# EAGLE design Rpi Shield V1.2 (EAGLE 9.5.2)
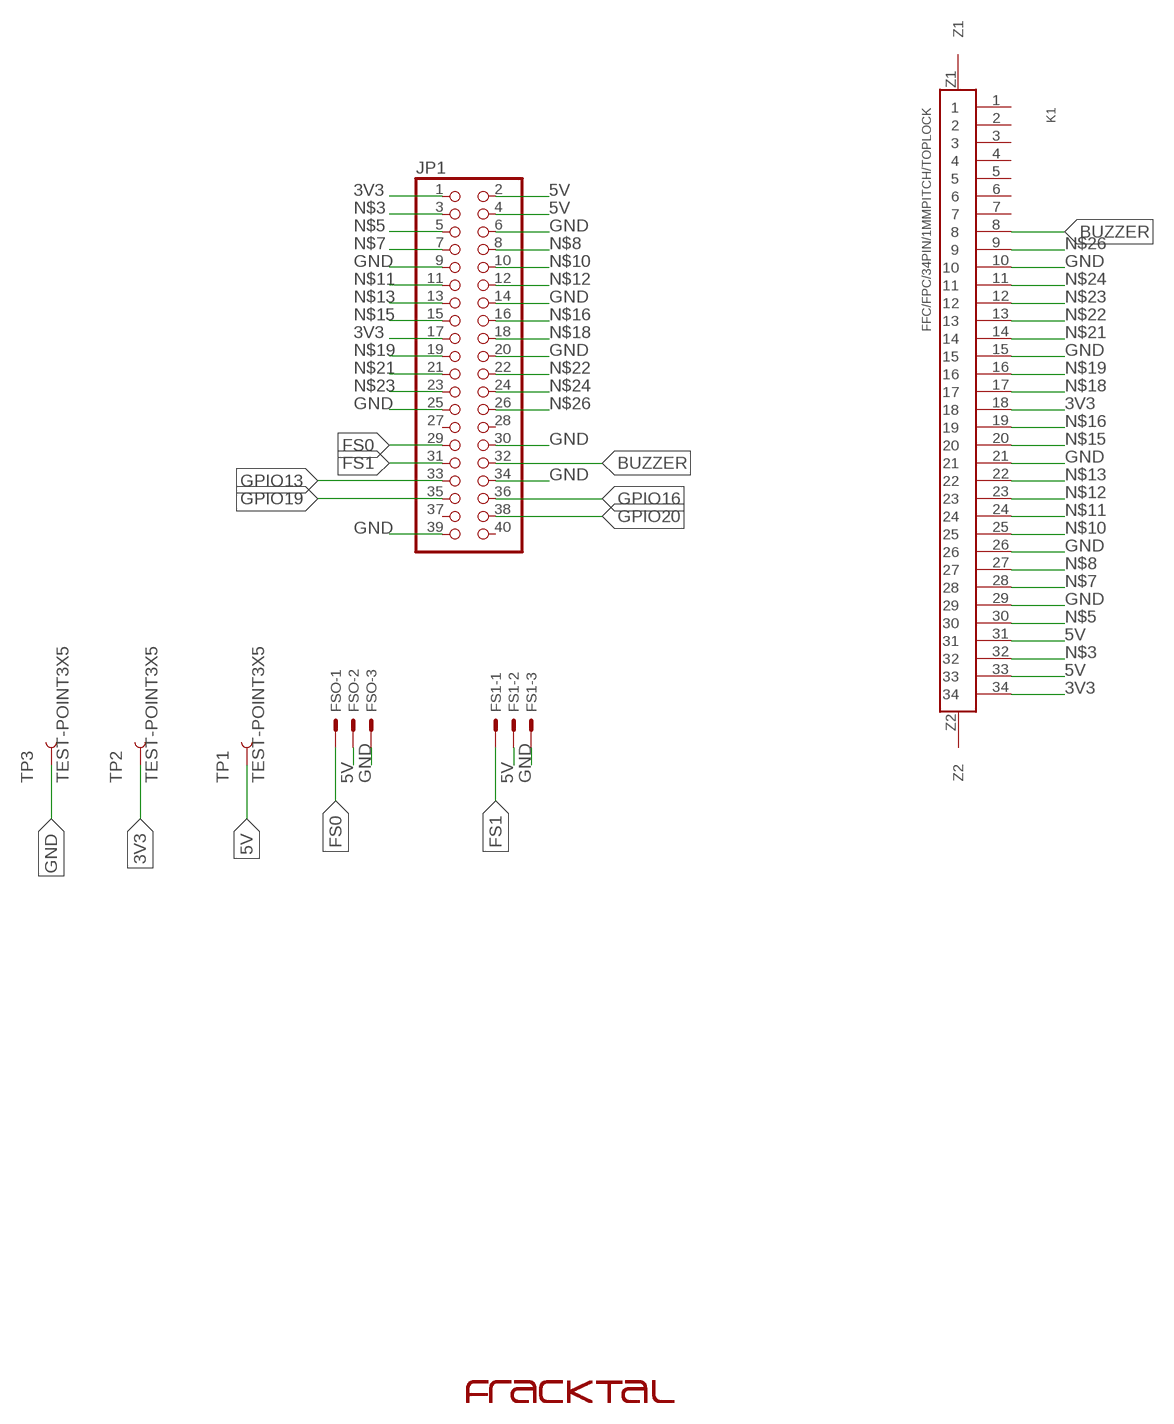
[diagram p0: schematic, sheet 1]

## Parts
FS1  JST-XH-03-PIN-LONG-PAD  [JST-XH-03-PACKAGE-LONG-PAD]
FSO  JST-XH-03-PIN-LONG-PAD  [JST-XH-03-PACKAGE-LONG-PAD]
JP1  RASPBERRYPI_3B_GPIO  [RASPBERRYPI_3B_GPIO]
K1  FFC/FPC/34PIN/1MMPITCH/TOPLOCK  [FFC/FPC/34PIN/1MMPITCH/TOPLOCK]
TP1  TEST-POINT3X5  [PAD.03X.05]
TP2  TEST-POINT3X5  [PAD.03X.05]
TP3  TEST-POINT3X5  [PAD.03X.05]
U$1  FRACKTALLOGO  [FRACKTALLOGO]

## Nets
3V3: JP1.1 JP1.17 K1.18 K1.34 TP2.P$1
5V: FS1.2 FSO.2 JP1.2 JP1.4 K1.31 K1.33 TP1.P$1
BUZZER: JP1.32 K1.8
FS0: FSO.1 JP1.29
FS1: FS1.1 JP1.31
GND: FS1.3 FSO.3 JP1.6 JP1.9 JP1.14 JP1.20 JP1.25 JP1.30 JP1.34 JP1.39 K1.10 K1.15 K1.21 K1.26 K1.29 TP3.P$1
GPIO13: JP1.33
GPIO16: JP1.36
GPIO19: JP1.35
GPIO20: JP1.38
N$3: JP1.3 K1.32
N$5: JP1.5 K1.30
N$7: JP1.7 K1.28
N$8: JP1.8 K1.27
N$10: JP1.10 K1.25
N$11: JP1.11 K1.24
N$12: JP1.12 K1.23
N$13: JP1.13 K1.22
N$15: JP1.15 K1.20
N$16: JP1.16 K1.19
N$18: JP1.18 K1.17
N$19: JP1.19 K1.16
N$21: JP1.21 K1.14
N$22: JP1.22 K1.13
N$23: JP1.23 K1.12
N$24: JP1.24 K1.11
N$26: JP1.26 K1.9
Unconnected: JP1.27 JP1.28 JP1.37 JP1.40 K1.1 K1.2 K1.3 K1.4 K1.5 K1.6 K1.7 K1.Z1 K1.Z2

## Library data of the parts
FS1 FSO = Rembrandt:JST-XH-03-PIN: JST XH Connector 2 Pin Wire to board connector. Pitch: 2,54 mm, (0.100") Number of pins: 3 Created by Rembrandt Electronics www.rembrandtelectronics.com
JP1 = FracktalWorks:RASPBERRYPI_3B_GPIO
K1 = FracktalWorks:FFC/FPC/34PIN/1MMPITCH/TOPLOCK
TP1-TP3 = SparkFun-Connectors:TEST-POINT: SparkFun Test Points Bare copper test points for troubleshooting or In-Circuit-Testing. These are used by our Production team for verifying production board runs using pogo-pins on test beds. SparkFun Products: SparkFun LSM9DS1 Breakout <https://www.sparkfun.com/products/13284> SparkFun PSOC <https://www.sparkfun.com/products/13714> SparkFun Load Cell Amplifier <https://www.sparkfun.com/products/13879>
U$1 = FracktalWorks_Eagle_Library:FRACKTALLOGO

## Net classes
0 default: width 0.406 mm

## Board
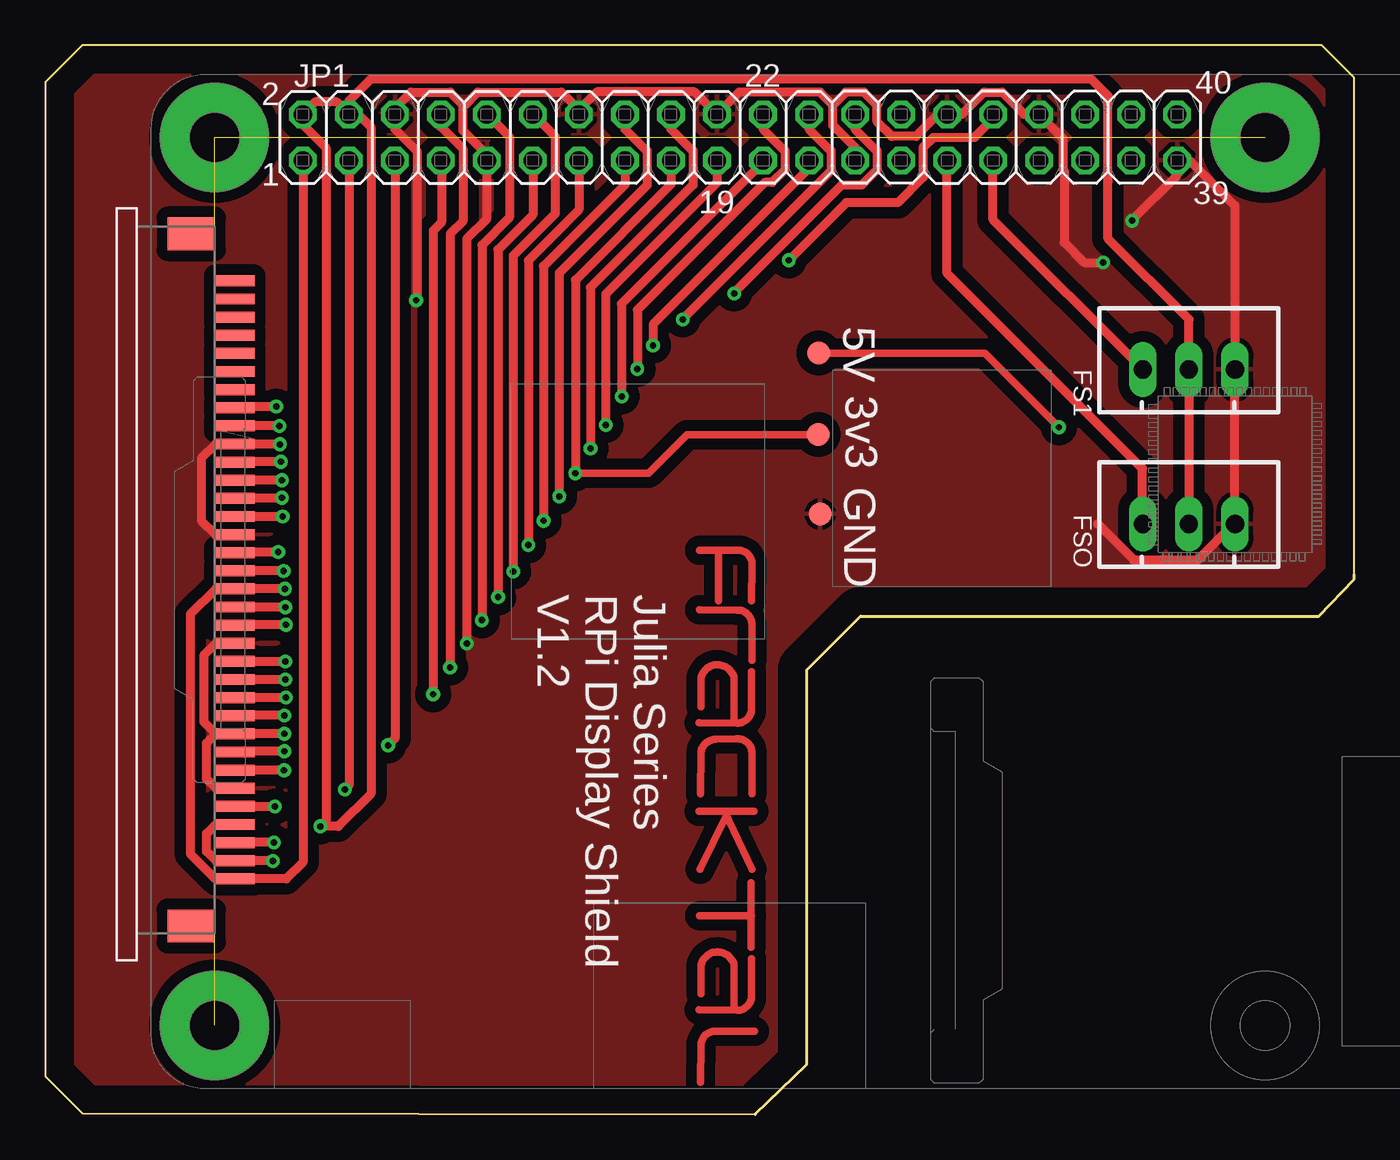
[diagram p1: board, top side]
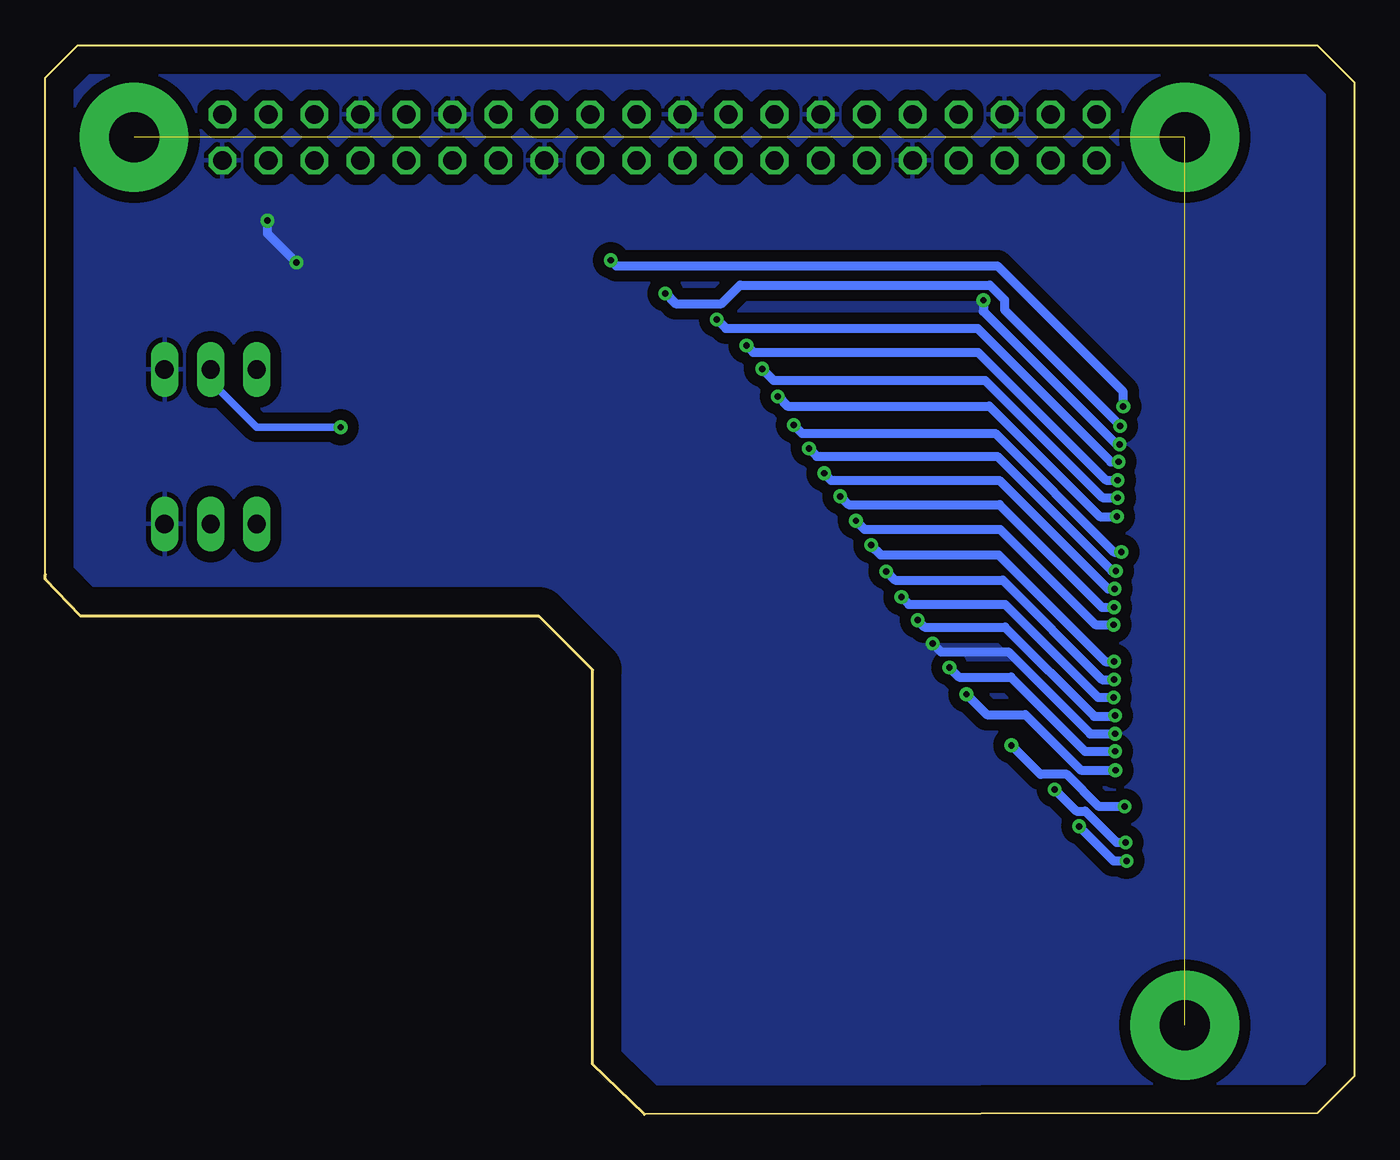
[diagram p2: board, bottom side, seen from below]

Size 72.26 x 59 mm. Coordinates in mm from the lower left corner, seen from the top.
Outline: 0,56.97 0,2.11 2.03,0.08 39.19,0 42.04,2.77 42.04,24.54 45.01,27.51 70.31,27.51 72.26,29.54 72.26,29.79 72.26,57.23 70.48,59 2.03,59 0,56.97
Copper layers (1*16): Top 0.035mm / dielectric 1.5mm / Bottom 0.035mm
Design rules "LionCircuits": minimum track width 8mil, minimum drill 0.35mm, track to track 8mil, track to pad 8mil, pad to pad 8mil, via to via 8mil, smd to smd 8mil, copper to edge 60mil, drill to drill 10mil, minimum pad ring 10mil, minimum via ring 8mil, stop-mask expansion 4mil, vias tented up to drill 0mil, thermal gap 10mil

### Footprints (pad centres in the part's own frame; a part is rotated, then mirrored left to right if it is on the bottom)
JST-XH-03-PACKAGE-LONG-PAD = drill 1.016 long: 1 -2.54,0; 2 0,0; 3 2.54,0
RASPBERRYPI_3B_GPIO = drill 1.016 octagon: 1 -24.13,-1.27; 2 -24.13,1.27; 3 -21.59,-1.27; 4 -21.59,1.27; 5 -19.05,-1.27; 6 -19.05,1.27; 7 -16.51,-1.27; 8 -16.51,1.27; 9 -13.97,-1.27; 10 -13.97,1.27; 11 -11.43,-1.27; 12 -11.43,1.27; 13 -8.89,-1.27; 14 -8.89,1.27; 15 -6.35,-1.27; 16 -6.35,1.27; 17 -3.81,-1.27; 18 -3.81,1.27; 19 -1.27,-1.27; 20 -1.27,1.27; 21 1.27,-1.27; 22 1.27,1.27; 23 3.81,-1.27; 24 3.81,1.27; 25 6.35,-1.27; 26 6.35,1.27; 27 8.89,-1.27; 28 8.89,1.27; 29 11.43,-1.27; 30 11.43,1.27; 31 13.97,-1.27; 32 13.97,1.27; 33 16.51,-1.27; 34 16.51,1.27; 35 19.05,-1.27; 36 19.05,1.27; 37 21.59,-1.27; 38 21.59,1.27; 39 24.13,-1.27; 40 24.13,1.27
FFC/FPC/34PIN/1MMPITCH/TOPLOCK = smd 0.6 x 2.2: 1 -14.43,2.1; 2 -13.43,2.1; 3 -12.43,2.1; 4 -11.43,2.1; 5 -10.43,2.1; 6 -9.43,2.1; 7 -8.43,2.1; 8 -7.43,2.1; 9 -6.43,2.1; 10 -5.43,2.1; 11 -4.43,2.1; 12 -3.43,2.1; 13 -2.43,2.1; 14 -1.43,2.1; 15 -0.43,2.1; 16 0.57,2.1; 17 1.57,2.1; 18 2.57,2.1; 19 3.57,2.1; 20 4.57,2.1; 21 5.57,2.1; 22 6.57,2.1; 23 7.57,2.1; 24 8.57,2.1; 25 9.57,2.1; 26 10.57,2.1; 27 11.57,2.1; 28 12.57,2.1; 29 13.57,2.1; 30 14.57,2.1; 31 15.57,2.1; 32 16.57,2.1; 33 17.57,2.1; 34 18.57,2.1 | smd 1.8 x 2.6: Z1 -17.03,-0.3; Z2 21.17,-0.3
PAD.03X.05 = smd 1.27 x 1.27: P$1 0,0

### Placement (x,y rotation side)
FS1  63.13,41.11 0 top
FSO  63.13,32.59 0 top
JP1  38.35,53.92 0 top
K1  8.36,31.57 270 top
TP1  42.7,42.01 0 top
TP2  42.67,37.52 0 top
TP3  42.77,33.15 0 top
U$1  36.02,19.15 270 top

### Tracks (layer width: path | path; a pad name or v marks a point on that pad's centre or on a via)
3V3  (via drill 0.35)
  Top 0.406: TP2.P$1 35.43,37.52 33.3,35.38 v29.26,35.38
  Top 0.508: JP1.1 14.22,13.92 13.31,13 K1.34 10.44,13.02 9.39,13.02 8.01,14.4 8.01,27.6 9.42,29.01 K1.18 v13.23,29 v13.23,29.01 | JP1.17 34.54,51.33 29.26,46.05 v29.26,35.38
  Bottom 0.508: v13.23,29.01 13.6,29.01 19.59,35 28.88,35 v29.26,35.38
5V  (via drill 0.35)
  Top 0.406: TP1.P$1 51.87,42.01 v55.96,37.92
  Top 0.508: JP1.4 16.76,55.93 17.98,57.15 57.73,57.15 58.67,56.21 58.67,51.51 58.69,51.5 58.67,51.48 58.67,48.34 63.13,43.88 FS1.2 FSO.2 | JP1.4 17.27,55.19 17.98,54.48 17.98,17.7 16.18,15.9 v15.19,15.9 15.49,16.21 15.49,53.34 14.22,54.61 JP1.2 14.91,55.88 16.08,55.88 JP1.4 | K1.31 9.42,16.01 8.9,15.49 8.9,14.51 9.42,13.99 10.45,13.99 K1.33 v12.57,14
  Bottom 0.406: v55.96,37.92 60.6,37.92 63.13,40.45 FS1.2
  Bottom 0.508: v15.19,15.9 13.28,14 v12.57,14
BUZZER  (via drill 0.35)
  Top 0.508: JP1.32 52.32,54.94 51.31,53.92 49.02,53.92 48.46,53.37 48.46,51.71 47.07,50.32 44.22,50.32 v41.05,47.14 | v12.75,39.07 10.52,39.07 K1.8
  Bottom 0.508: v41.05,47.14 40.74,46.84 19.71,46.84 12.75,39.88 v12.75,39.07
FS0
  Top 0.508: JP1.29 49.78,46.43 60.58,35.64 60.58,32.6 FSO.1
FS1
  Top 0.508: FS1.1 52.32,49.38 JP1.31
GND  (via drill 0.35)
  Top 0.508: 43.48,55.7 44.2,56.41 45.21,56.41 45.92,55.7 45.92,54.79 46.74,53.98 48.07,53.98 49.29,55.19 JP1.30 50.6,55.19 51.82,56.41 52.83,56.41 54.05,55.19 JP1.34 56.18,53.87 56.18,52.15 56.26,52.07 56.26,48.13 57.38,47.02 v58.39,47.02 | JP1.25 44.7,53.37 43.48,54.59 43.48,55.7 | 58.11,32.59 60.09,30.61 63.64,30.61 65.62,32.59 FSO.3 FS1.3 65.67,50.15 63.17,52.65 JP1.39 62.48,51.84 59.99,49.35 v59.99,49.33 | 23.06,55.7 22.35,56.41 20.2,56.41 19.3,55.52 JP1.6 19.3,54.38 20.52,53.16 20.52,44.98 v20.47,44.93 | 23.06,55.7 23.06,54.3 24.38,52.97 JP1.9 24.38,49.43 23.27,48.32 v23.27,25.98 | 43.48,55.7 42.77,56.41 38.3,56.41 JP1.20 35.84,56.44 30.46,56.44 29.46,55.45 | 23.06,55.7 23.17,55.7 23.88,56.41 28.5,56.41 29.46,55.45 | 29.46,55.45 JP1.14 | K1.29 10.45,17.99 9.42,17.99 8.9,18.51 8.9,20.49 9.17,20.76 9.19,20.76 9.42,20.99 | K1.21 9.42,26.01 8.75,25.34 8.75,21.67 9.42,20.99 | K1.15 10.44,31.99 9.4,31.99 8.62,32.77 8.62,36.21 9.4,36.99 10.44,36.99 | K1.10 10.44,36.99 | v12.95,36.98 v12.95,36.99 10.44,36.99 | v13.21,21.01 v13.2,21 K1.26 10.45,20.99 9.42,20.99
  Bottom 0.508: v58.39,47.02 59.99,48.62 v59.99,49.33 | v20.47,44.93 20.47,44.32 13.13,36.98 v12.95,36.98 | v23.27,25.98 22.81,25.53 19.1,25.53 14.58,21.01 v13.21,21.01
  pour Bottom (isolate 0.61): 2.29,59.89 -0.25,57.35 -0.25,2.67 -0.25,1.93 1.78,-0.1 1.98,-0.3 39.98,-0.3 40.56,-0.3 42.82,1.96 42.82,24.43 45.49,27.1 45.49,27.18 70.99,27.18 72.75,28.93 72.75,56.72 72.44,57.02 70.61,58.85 70.41,58.85 3.38,58.85 2.39,59.84
  pour Top (isolate 0.61): 1.96,59.23 -0.64,56.64 -0.64,2.57 1.73,0.2 39.34,0.2 39.5,0.05 39.5,0.2 42.29,3 42.29,26.75 68.78,26.75 72.69,30.66 73.43,30.66 72.26,31.83 72.26,59.05 2.24,59.05 2.06,59.23
N$2  (via drill 2.75 pad 6)  (2 unrouted)
  other vias: 9.35,53.92 67.36,53.92 9.35,4.93
N$3  (via drill 0.35)
  Top 0.508: JP1.3 16.76,18.16 v16.54,17.93 | v12.62,15.01 10.47,15.01 K1.32
  Bottom 0.508: v16.54,17.93 15.34,16.74 14.84,16.74 13.12,15.01 v12.62,15.01
N$5  (via drill 0.35)
  Top 0.508: JP1.5 19.3,20.75 v18.92,20.37 | K1.30 v12.66,17 v12.67,16.99
  Bottom 0.508: v12.67,16.99 14.09,16.99 15.87,18.77 17.32,18.77 v18.92,20.37
N$7  (via drill 0.35)
  Top 0.508: v13.18,19 K1.28 | v21.41,23.19 21.41,48.78 21.87,49.24 21.87,52.63 JP1.7
  Bottom 0.508: v21.41,23.19 20.29,22.07 18.17,22.07 15.09,19 v13.18,19
N$8  (via drill 0.35)
  Top 0.508: JP1.8 21.84,54.51 23.06,53.29 23.06,49.31 22.35,48.6 v22.35,24.66 | v13.21,20.04 10.49,20.04 K1.27
  Bottom 0.508: v22.35,24.66 21.82,24.13 18.95,24.13 14.86,20.04 v13.21,20.04
N$10  (via drill 0.35)
  Top 0.508: JP1.10 25.63,53.95 25.63,49.5 24.11,47.98 v24.11,27.28 | v13.21,22.02 10.48,22.02 K1.25
  Bottom 0.508: v24.11,27.28 23.72,26.9 19.28,26.9 14.35,21.97 13.26,21.97 v13.21,22.02
N$11  (via drill 0.35)
  Top 0.508: v24.99,28.55 24.99,47.73 26.92,49.66 JP1.11 | v13.28,23.01 13.27,23 K1.24
  Bottom 0.508: v24.99,28.55 24.59,28.14 19.28,28.14 14.15,23.01 v13.28,23.01
N$12  (via drill 0.35)
  Top 0.508: JP1.12 28.14,53.98 28.14,49.71 25.83,47.4 v25.83,29.97 | v13.26,24 K1.23
  Bottom 0.508: v25.83,29.97 25.35,29.49 19.41,29.49 13.92,24 v13.26,24
N$13  (via drill 0.35)
  Top 0.508: JP1.13 29.46,49.93 26.67,47.14 v26.67,31.42 | v13.26,24.99 10.46,24.99 K1.22
  Bottom 0.508: v13.26,24.99 13.75,24.99 19.64,30.88 26.13,30.88 v26.67,31.42
N$15  (via drill 0.35)
  Top 0.508: JP1.15 32,51.31 27.51,46.81 v27.51,32.77 | v13.28,27.03 10.48,27.03 K1.20
  Bottom 0.508: v27.51,32.77 27.03,32.28 19.56,32.28 14.3,27.03 v13.28,27.03
N$16  (via drill 0.35)
  Top 0.508: JP1.16 32,54.38 33.22,53.16 33.22,51.28 29.52,47.57 28.37,46.43 v28.37,34.11 | v13.26,27.99 10.47,27.99 K1.19
  Bottom 0.508: v28.37,34.11 27.92,33.66 19.58,33.66 13.92,27.99 v13.26,27.99
N$18  (via drill 0.35)
  Top 0.508: JP1.18 34.54,54.38 35.76,53.16 35.76,51.31 30.1,45.64 v30.1,36.75 | v13.16,30 K1.17
  Bottom 0.508: v30.1,36.75 29.66,36.32 19.7,36.32 13.38,30 v13.16,30
N$19  (via drill 0.35)
  Top 0.508: JP1.19 37.08,51.42 30.94,45.27 v30.94,38.05 | v12.85,31.04 10.49,31.04 K1.16
  Bottom 0.508: v12.85,31.04 13.26,31.04 19.81,37.59 30.48,37.59 v30.94,38.05
N$21  (via drill 0.35)
  Top 0.508: JP1.21 39.62,52.55 31.8,44.73 31.8,39.65 v31.83,39.62 | v13.11,32.99 10.46,32.99 K1.14
  Bottom 0.508: v31.83,39.62 31.29,39.09 20.14,39.09 14.05,32.99 v13.11,32.99
N$22  (via drill 0.35)
  Top 0.508: v32.69,41.15 32.69,44.4 39.73,51.44 40.13,51.44 40.84,52.15 40.84,53.16 39.62,54.38 JP1.22 | v13.06,34.04 13.02,34 K1.13
  Bottom 0.508: v32.69,41.15 32.05,40.51 20.38,40.51 13.9,34.04 v13.06,34.04
N$23  (via drill 0.35)
  Top 0.508: v13.06,35 v13.05,35 K1.12 | v33.55,42.44 33.55,43.6 42.16,52.21 JP1.23
  Bottom 0.508: v13.06,35 13.71,35 20.77,42.06 33.17,42.06 v33.55,42.44
N$24  (via drill 0.35)
  Top 0.508: JP1.24 42.16,54.38 43.38,53.16 43.38,52.07 v35.19,43.88 | v13,36.02 10.47,36.02 K1.11
  Bottom 0.508: v35.19,43.88 34.69,43.38 20.8,43.38 13.44,36.02 v13,36.02
N$26  (via drill 0.35)
  Top 0.508: JP1.26 44.7,54.38 45.92,53.16 45.92,52.15 45.08,51.31 43.98,51.31 38.03,45.36 v38.03,45.31 | v12.93,38 K1.9
  Bottom 0.508: v38.03,45.31 37.47,44.75 34.92,44.75 33.9,45.77 20.13,45.77 19.31,44.95 19.31,44.42 12.93,38.04 v12.93,38

### Text on the board
tPlace: 5V | 3v3 | GND | Julia Series / RPi Display Shield / V1.2
tNames: 22 | 2 | 40 | 1 | 19 | 39